# Altium schematic sheet CONVERTER_ALTIUM.SchDoc
size A; SheetNumber: 1; SheetTotal: 1
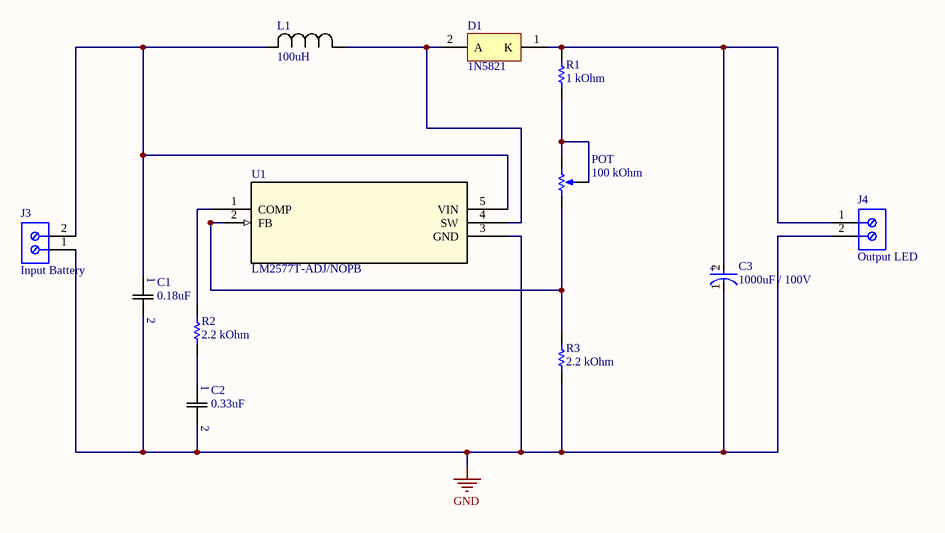
[diagram p0: CONVERTER_ALTIUM.SchDoc]

## Parts
C1  0.18uF  [CAP_C322C_MR_X7R_KEM]
C2  0.33uF  [CAP_C330_MR_X7R_KEM]
C3  1000uF / 100V  [FP-RAD-TH-D_16_0_5-L_25_2-MFG]
D1  1N5821  [ONSC-AXIAL_LEAD-2-267-05_V]
J3  Input Battery  [691102710002]
J4  Output LED  [691102710002]
L1  100uH  [IND_PE-53115NL_PUL]
POT  100 kOhm  [BOUR-3362P]
R1  1 kOhm  [RESA60-630X240]
R2  2.2 kOhm  [RESA60-630X240]
R3  2.2 kOhm  [RESA60-630X240]
U1  LM2577T-ADJ/NOPB  [T05A_TEX]

## Nets
GND: C1.2 C2.2 C3.1(C) J3.1 J4.2 R3.1 U1.3(GND)
NetC1_1: C1.1 J3.2 L1.2 U1.5(VIN)
NetC2_1: C2.1 R2.1
NetC3_2: C3.2(A) D1.1(K) J4.1 R1.2
NetD1_2: D1.2(A) L1.1 U1.4(SW)
NetPOT_1: POT.1(CCW) R3.2 U1.2(FB)
NetPOT_2: POT.2(S) POT.3(CW) R1.1
NetR2_2: R2.2 U1.1(COMP)

## Notes on the sheet
- (in symbol CMP-05427-000487-1) +

## Library data of the parts
C1 = C322C184K5R5TA: No Description Available; Mfr_Name: Kemet; Type: DEV; Copyright: Copyright (C) 2022 Ultra Librarian. All rights reserved.; Manufacturer_Part_Number: C322C184K5R5TA; Digi-Key_Part_Number_1: 399-C322C184K5R5TA-ND; RefDes: RefDes
C2 = 0.33uF Cap: No Description Available; Mfr_Name: Kemet; Manufacturer_Part_Number: C330C334K5R5TA; Type: DEV; Copyright: Copyright (C) 2022 Ultra Librarian. All rights reserved.; Digi-Key_Part_Number_1: 399-4408-ND; RefDes: RefDes
C3 = CMP-05427-000487-1: Aluminum Electrolytic Capacitors (Radial Lead Type) 1000uF ±20% 50V; Ripple Current: 3.32A; Impedance: 16mR; Polarity: Polar; Life (Hours): 10000Hour; Capacitance: 1mF; Lead Diameter: 0.8mm; Mount: Through Hole; Series: FR; Package Quantity: 250; Length: 25mm; Radiation Hardening: No; REACH SVHC: No SVHC; Case/Package: Radial; Height: 25mm; Min Operating Temperature: -40°C; Contact Plating: Tin; Lead Free: Lead Free; Height - Seated (Max): 0.984inch; RoHS Compliant: Yes; Features: General Purpose; ESR (Equivalent Series Resistance): 16mR; Voltage Rating: 50V; Diameter: 16mm; Voltage Rating (DC): 50V; Max Operating Temperature: 105°C; Lead Pitch: 7.5mm; Packaging: Tape and Reel; Number of Pins: 2; Tolerance: 20%; Termination: Through Hole
D1 = CMP-1055-00029-1: Rectifier, 2-Pin Axial_Lead, Bulk Bag; Manufacturer: On Semiconductor; Configuration: Single; Note1: 0; IFSM Max (A): 80; PartNumber: 1N5821; RoHS: FALSE; DatasheetVersion: Rev. 10; ComponentLink1URL: http://www.onsemi.com/; ComponentLink3Description: Package Specification; Mounting Technology: Through Hole; ComponentLink2Description: Datasheet; ComponentLink3URL: http://www.onsemi.com/pub_link/Collateral/267-05.PDF; ComponentLink1Description: Manufacturer URL; PackageVersion: Rev. G, 06/2000; Packing: Bulk Bag; PackageReference: AXIAL_LEAD-2-267-05; PackageDescription: 2-Pin, Axial Lead, Diameter 5.05 mm; ComponentLink2URL: http://www.onsemi.cn/pub_link/Collateral/1N5820-D.PDF
J3 J4 = CMP-1502-03258-1: Series 102 - 5.00 mm Horizontal Entry Modular with Pressure Clamp WR-TBL, 2 pin; Manufacturer: Wurth Elektronik; Pin Number: 2; Pitch: 5.00mm; Manufacturer URL: http://www.we-online.de; Mounting Technology: THT; Publisher: WurthElektronik; Packaging: Box; Package Reference: 691102710002; Datasheet URL: http://katalog.we-online.de/em/datasheet/6911027100xx.pdf; Operating Temperature: -40to105degC; Part Number: 691102710002
L1 = PE-53115NL: No Description Available; Mfr_Name: Pulse Electronics Corporation; Type: DEV; Copyright: Copyright (C) 2022 Ultra Librarian. All rights reserved.; Manufacturer_Part_Number: PE-53115NL; Digi-Key_Part_Number_1: 553-1566-5-ND; RefDes: RefDes
POT = CMP-1747-00004-1: Square Trimpot(R) Trimming Potentiometer, 10 KOhm, 300 V, -55 to 125 degC, 3-Pin THD, RoHS, Tube; Voltage Rating: 220 mV; Power Rating: 1 W; Tolerance: 1%; Resistance: 50 mohm; Case/Package: 1206; Length: 3.2 mm; RoHSCompliant: True; PackageDescription: 3-Pin Through Hole Device, Body 6.6 x 6.99 mm, Pitch 2.54 mm; ComponentLink2Description: Datasheet; REACH SVHC: No SVHC; Mount: Surface Mount; Height: 0.6 mm; Packaging: Tape and Reel; ComponentLink1URL: http://www.bourns.com/; Case Code (Imperial): 0612; Pins: 2; Case Code (Metric): 1632; ComponentLink2URL: http://www.bourns.com/docs/Product-Datasheets/3362.pdf; Min Operating Temperature: -25degC; ComponentLink1Description: Manufacturer URL; PackageReference: 3326P; Max Operating Temperature: 125degC; Width: 1.6 mm; Package Quantity: 5000; DatasheetVersion: May-16
R1-R3 = CMP-1659-00075-1: Axial Resistor, 1 KOhm, +/- 1%, 250 mW, -55 to 155 degC, 2-Pin THD, RoHS, Bulk; Voltage Rating: 250 V; Resistance: 10 kohm; Power Rating: 250 mW; ComponentLink2Description: Datasheet; RoHSCompliant: true; PackageReference: MFR-25; Case\Package: Axial; Max Operating Temperature: 155 degC; DatasheetVersion: Apr-13; Tolerance: 1%; ComponentLink1URL: http://www.yageo.com/; Length: 0.248 inch; ComponentLink2URL: http://www.yageo.com/documents/recent/Yageo%20LR_MFR_2013.pdf; Packaging: Bulk; Package Quantity: 200; PackageDescription: 2-Pin Axial Lead, Dia 2.4 mm, Body Length 6.3 mm; Min Operating Temperature: -55 degC; ComponentLink1Description: Manufacturer URL
U1 = LM2577T-ADJ/NOPB: No Description Available; Mfr_Name: Texas Instruments; Copyright: Copyright (C) 2022 Ultra Librarian. All rights reserved.; Manufacturer_Part_Number: LM2577T-ADJ/NOPB; Digi-Key_Part_Number_1: LM2577T-ADJ/NOPB-ND; Digi-Key_Part_Number_2: 2156-LM2577T-ADJ/NOPB-ND; Digi-Key_Part_Number_3: 2156-LM2577T-ADJ/NOPB-TI-ND; RefDes: RefDes; Type: DEV